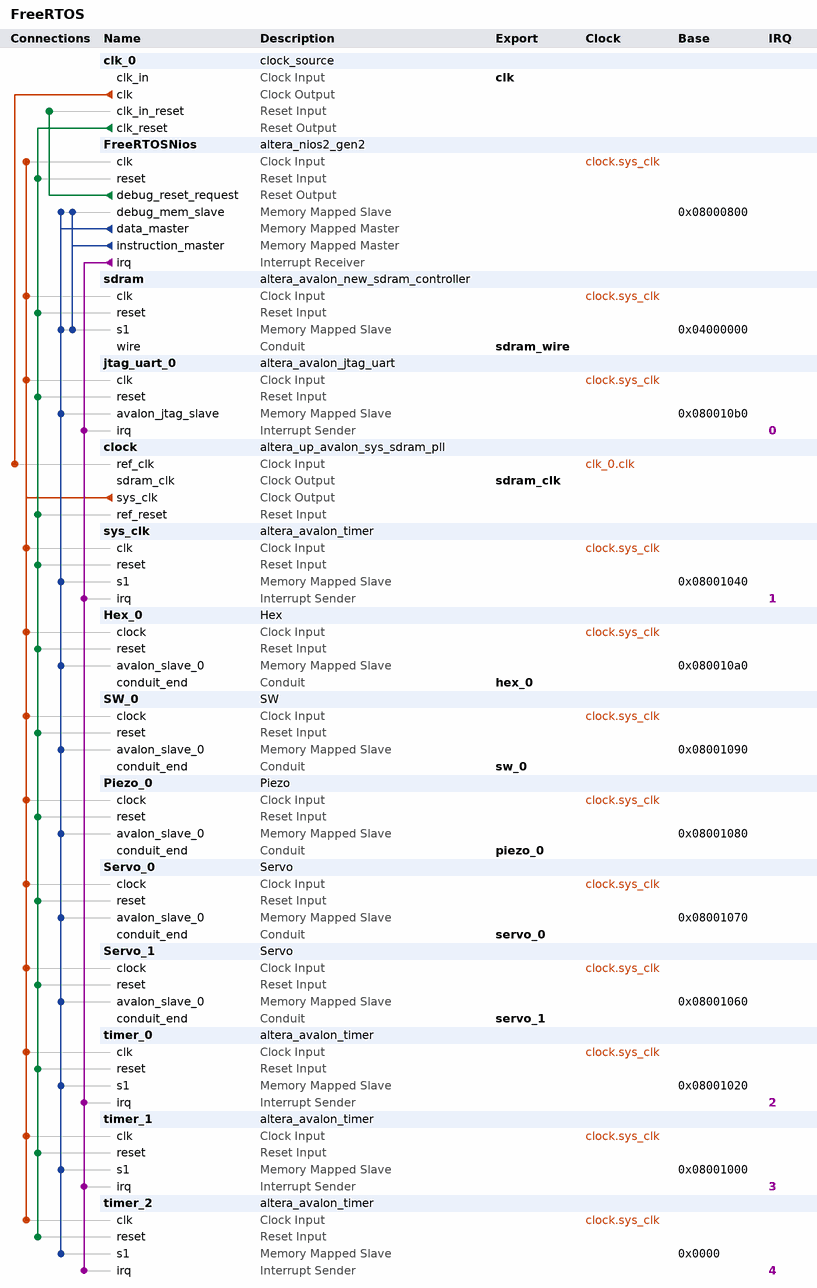
[diagram p0: system contents]
# Platform Designer (Qsys) system FreeRTOS, Cyclone V 5CSEMA5F31C6
# Parameters at their usual value, and those the tool derives, are not listed.
package require -exact qsys 20.1
create_system FreeRTOS
set_project_property DEVICE_FAMILY {Cyclone V}
set_project_property DEVICE 5CSEMA5F31C6

add_instance clk_0 clock_source 20.1
set_instance_parameter_value clk_0 clockFrequency 50000000

add_instance FreeRTOSNios altera_nios2_gen2 20.1
set_instance_parameter_value FreeRTOSNios dcache_size 2048
set_instance_parameter_value FreeRTOSNios exceptionSlave sdram.s1
set_instance_parameter_value FreeRTOSNios icache_size 4096
set_instance_parameter_value FreeRTOSNios impl Fast
set_instance_parameter_value FreeRTOSNios resetSlave sdram.s1

add_instance sdram altera_avalon_new_sdram_controller 20.1
set_instance_parameter_value sdram TAC 5.4
set_instance_parameter_value sdram TRCD 20.0
set_instance_parameter_value sdram TRFC 15.0
set_instance_parameter_value sdram TRP 15.0
set_instance_parameter_value sdram casLatency 3
set_instance_parameter_value sdram columnWidth 10
set_instance_parameter_value sdram dataWidth 16
set_instance_parameter_value sdram generateSimulationModel false
set_instance_parameter_value sdram model single_Micron_MT48LC4M32B2_7_chip
set_instance_parameter_value sdram numberOfBanks 4
set_instance_parameter_value sdram numberOfChipSelects 1
set_instance_parameter_value sdram powerUpDelay 100.0
set_instance_parameter_value sdram refreshPeriod 7.8125
set_instance_parameter_value sdram rowWidth 13

add_instance jtag_uart_0 altera_avalon_jtag_uart 20.1
set_instance_parameter_value jtag_uart_0 simInteractiveOptions NO_INTERACTIVE_WINDOWS

add_instance clock altera_up_avalon_sys_sdram_pll 18.0
set_instance_parameter_value clock CV_boards DE1-SoC
set_instance_parameter_value clock gui_outclk 50.0
set_instance_parameter_value clock gui_refclk 50.0

add_instance sys_clk altera_avalon_timer 20.1
set_instance_parameter_value sys_clk period 1
set_instance_parameter_value sys_clk periodUnits MSEC

add_instance Hex_0 Hex 1.0

add_instance SW_0 SW 1.0

add_instance Piezo_0 Piezo 1.0

add_instance Servo_0 Servo 1.0

add_instance Servo_1 Servo 1.0

add_instance timer_0 altera_avalon_timer 20.1
set_instance_parameter_value timer_0 period 100
set_instance_parameter_value timer_0 periodUnits USEC

add_instance timer_1 altera_avalon_timer 20.1
set_instance_parameter_value timer_1 period 100
set_instance_parameter_value timer_1 periodUnits USEC

add_instance timer_2 altera_avalon_timer 20.1
set_instance_parameter_value timer_2 period 100
set_instance_parameter_value timer_2 periodUnits USEC

# connections
add_connection clk_0.clk clock.ref_clk clock
add_connection clock.sys_clk FreeRTOSNios.clk clock
add_connection clock.sys_clk Hex_0.clock clock
add_connection clock.sys_clk jtag_uart_0.clk clock
add_connection clock.sys_clk Piezo_0.clock clock
add_connection clock.sys_clk sdram.clk clock
add_connection clock.sys_clk Servo_0.clock clock
add_connection clock.sys_clk Servo_1.clock clock
add_connection clock.sys_clk SW_0.clock clock
add_connection clock.sys_clk sys_clk.clk clock
add_connection clock.sys_clk timer_0.clk clock
add_connection clock.sys_clk timer_1.clk clock
add_connection clock.sys_clk timer_2.clk clock
add_connection clk_0.clk_reset clock.ref_reset reset
add_connection clk_0.clk_reset FreeRTOSNios.reset reset
add_connection clk_0.clk_reset Hex_0.reset reset
add_connection clk_0.clk_reset jtag_uart_0.reset reset
add_connection clk_0.clk_reset Piezo_0.reset reset
add_connection clk_0.clk_reset sdram.reset reset
add_connection clk_0.clk_reset Servo_0.reset reset
add_connection clk_0.clk_reset Servo_1.reset reset
add_connection clk_0.clk_reset SW_0.reset reset
add_connection clk_0.clk_reset sys_clk.reset reset
add_connection clk_0.clk_reset timer_0.reset reset
add_connection clk_0.clk_reset timer_1.reset reset
add_connection clk_0.clk_reset timer_2.reset reset
add_connection FreeRTOSNios.debug_reset_request clk_0.clk_in_reset reset
add_connection FreeRTOSNios.data_master FreeRTOSNios.debug_mem_slave avalon
set_connection_parameter_value FreeRTOSNios.data_master/FreeRTOSNios.debug_mem_slave baseAddress 0x08000800
add_connection FreeRTOSNios.data_master Hex_0.avalon_slave_0 avalon
set_connection_parameter_value FreeRTOSNios.data_master/Hex_0.avalon_slave_0 baseAddress 0x080010a0
add_connection FreeRTOSNios.data_master jtag_uart_0.avalon_jtag_slave avalon
set_connection_parameter_value FreeRTOSNios.data_master/jtag_uart_0.avalon_jtag_slave baseAddress 0x080010b0
add_connection FreeRTOSNios.data_master Piezo_0.avalon_slave_0 avalon
set_connection_parameter_value FreeRTOSNios.data_master/Piezo_0.avalon_slave_0 baseAddress 0x08001080
add_connection FreeRTOSNios.data_master sdram.s1 avalon
set_connection_parameter_value FreeRTOSNios.data_master/sdram.s1 baseAddress 0x04000000
add_connection FreeRTOSNios.data_master Servo_0.avalon_slave_0 avalon
set_connection_parameter_value FreeRTOSNios.data_master/Servo_0.avalon_slave_0 baseAddress 0x08001070
add_connection FreeRTOSNios.data_master Servo_1.avalon_slave_0 avalon
set_connection_parameter_value FreeRTOSNios.data_master/Servo_1.avalon_slave_0 baseAddress 0x08001060
add_connection FreeRTOSNios.data_master SW_0.avalon_slave_0 avalon
set_connection_parameter_value FreeRTOSNios.data_master/SW_0.avalon_slave_0 baseAddress 0x08001090
add_connection FreeRTOSNios.data_master sys_clk.s1 avalon
set_connection_parameter_value FreeRTOSNios.data_master/sys_clk.s1 baseAddress 0x08001040
add_connection FreeRTOSNios.data_master timer_0.s1 avalon
set_connection_parameter_value FreeRTOSNios.data_master/timer_0.s1 baseAddress 0x08001020
add_connection FreeRTOSNios.data_master timer_1.s1 avalon
set_connection_parameter_value FreeRTOSNios.data_master/timer_1.s1 baseAddress 0x08001000
add_connection FreeRTOSNios.data_master timer_2.s1 avalon
set_connection_parameter_value FreeRTOSNios.data_master/timer_2.s1 baseAddress 0x0000
add_connection FreeRTOSNios.instruction_master FreeRTOSNios.debug_mem_slave avalon
set_connection_parameter_value FreeRTOSNios.instruction_master/FreeRTOSNios.debug_mem_slave baseAddress 0x08000800
add_connection FreeRTOSNios.instruction_master sdram.s1 avalon
set_connection_parameter_value FreeRTOSNios.instruction_master/sdram.s1 baseAddress 0x04000000
add_connection FreeRTOSNios.irq jtag_uart_0.irq interrupt
set_connection_parameter_value FreeRTOSNios.irq/jtag_uart_0.irq irqNumber 0
add_connection FreeRTOSNios.irq sys_clk.irq interrupt
set_connection_parameter_value FreeRTOSNios.irq/sys_clk.irq irqNumber 1
add_connection FreeRTOSNios.irq timer_0.irq interrupt
set_connection_parameter_value FreeRTOSNios.irq/timer_0.irq irqNumber 2
add_connection FreeRTOSNios.irq timer_1.irq interrupt
set_connection_parameter_value FreeRTOSNios.irq/timer_1.irq irqNumber 3
add_connection FreeRTOSNios.irq timer_2.irq interrupt
set_connection_parameter_value FreeRTOSNios.irq/timer_2.irq irqNumber 4

# exported interfaces
add_interface clk clock sink
set_interface_property clk EXPORT_OF clk_0.clk_in
add_interface hex_0 conduit end
set_interface_property hex_0 EXPORT_OF Hex_0.conduit_end
add_interface piezo_0 conduit end
set_interface_property piezo_0 EXPORT_OF Piezo_0.conduit_end
add_interface sdram_clk clock source
set_interface_property sdram_clk EXPORT_OF clock.sdram_clk
add_interface sdram_wire conduit end
set_interface_property sdram_wire EXPORT_OF sdram.wire
add_interface servo_0 conduit end
set_interface_property servo_0 EXPORT_OF Servo_0.conduit_end
add_interface servo_1 conduit end
set_interface_property servo_1 EXPORT_OF Servo_1.conduit_end
add_interface sw_0 conduit end
set_interface_property sw_0 EXPORT_OF SW_0.conduit_end

set_interconnect_requirement {$system} qsys_mm.clockCrossingAdapter HANDSHAKE
set_interconnect_requirement {$system} qsys_mm.enableEccProtection FALSE
set_interconnect_requirement {$system} qsys_mm.insertDefaultSlave FALSE
set_interconnect_requirement {$system} qsys_mm.maxAdditionalLatency 1

save_system FreeRTOS.qsys
